# EasyEDA Pro project 实战派S3电池包.epro

# Schematic batterypack
Board Name: 扩展板; Create Date: 2025-04-08; Page Name: P1; Project Name: 实战派s3电池包; Schematic Name: batterypack; Update Date: 2025-04-08; Company: 嘉立创EDA; Page Size: A4; Version: V1.0
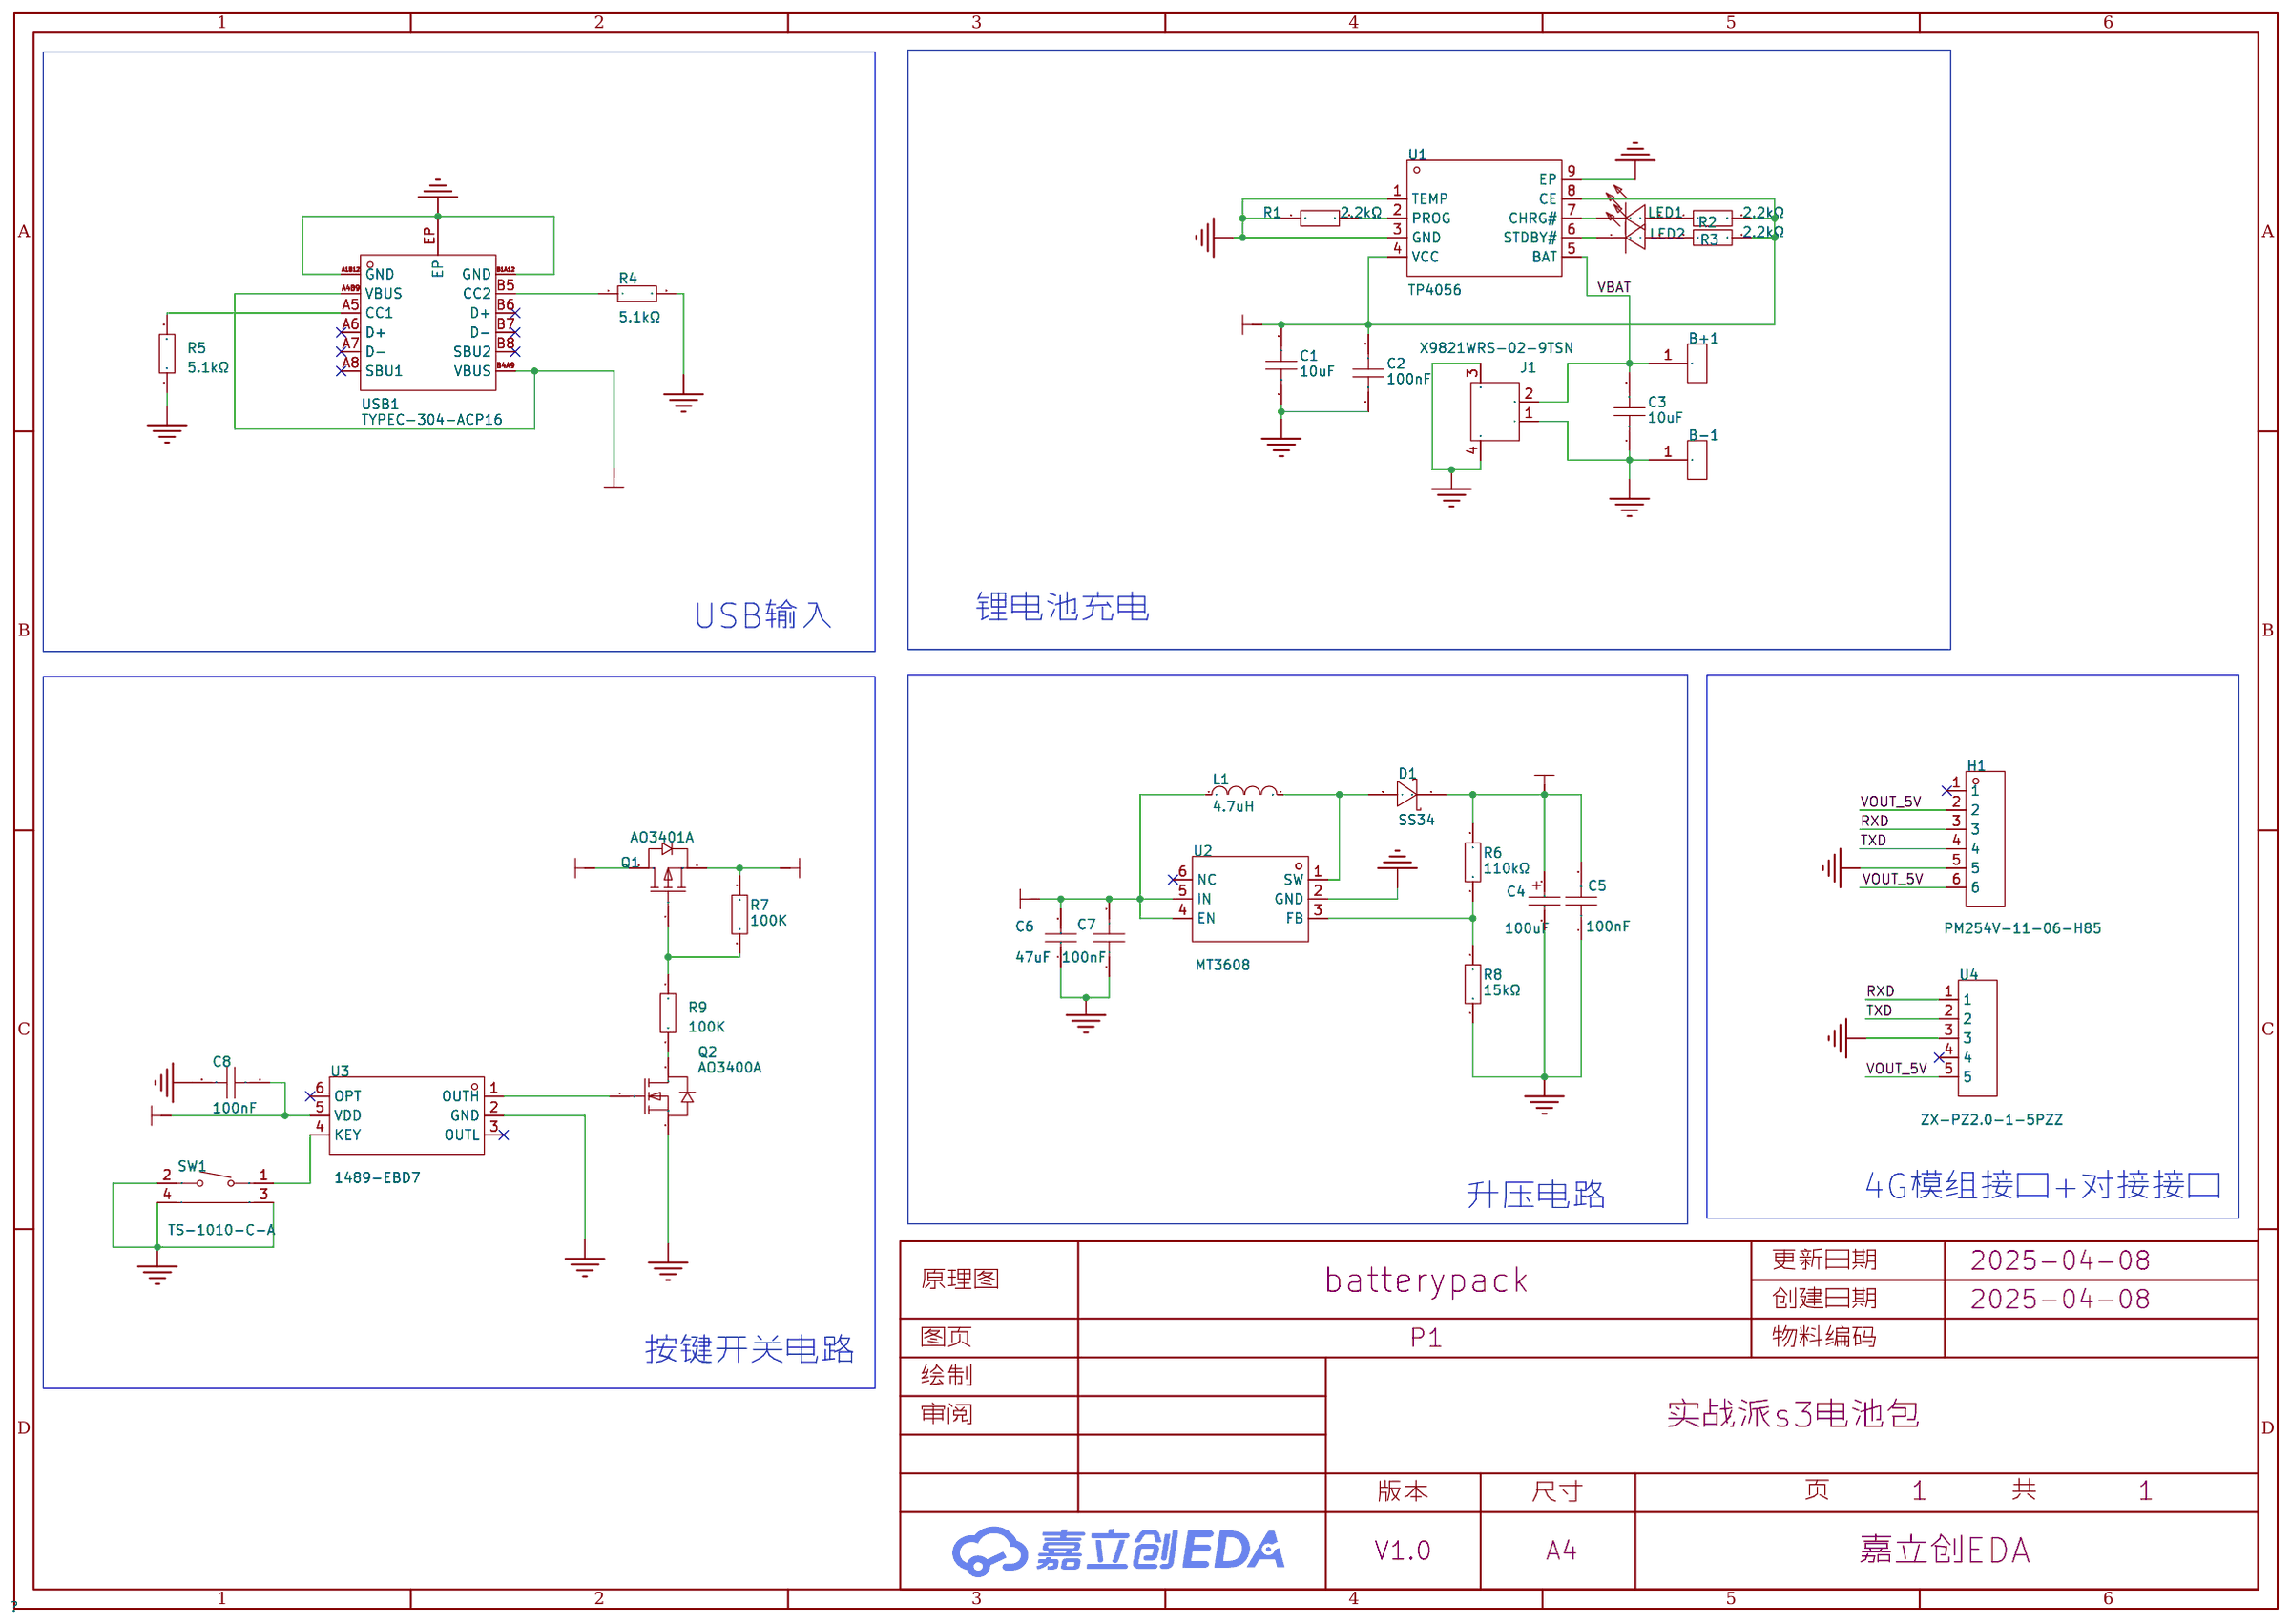
[diagram p0: schematic sheet]

## Parts
B+1  -  [test_point]
B-1  -  [test_point]
C1  10uF  [C0603]
C2  100nF  [C0402]
C3  10uF  [C0603]
C4  100uF  [CASE-B_3528]
C5  100nF  [C0402]
C6  47uF  [C0805]
C7  100nF  [C0402]
C8  100nF  [C0402]
D1  SS34  [SMA_L4.3-W2.6-LS5.2-RD]
H1  PM254V-11-06-H85  [HDR-TH_6P-P2.54-V-F]
J1  X9821WRS-02-9TSN  [CONN-SMD_2P-P1.25_X9821WRS-02-9TSN]
L1  4.7uH  [IND-SMD_L4.4-W4.2]
LED1  KT-0603R  [LED0603-RD]
LED2  KT-0603G  [LED0603-RD]
Q1  AO3401A  [SOT-23_L2.9-W1.3-P1.90-LS2.4-BR]
Q2  AO3400A  [SOT-23-3_L2.9-W1.3-P1.90-LS2.4-BR]
R1  2.2kΩ  [R0402]
R2  2.2kΩ  [R0402]
R3  2.2kΩ  [R0402]
R4  5.1kΩ  [R0402]
R5  5.1kΩ  [R0402]
R6  110kΩ  [R0402]
R7  100K  [R0402]
R8  15kΩ  [R0402]
R9  100K  [R0402]
SW1  TS-1010-C-A  [KEY-SMD_TX-1010-X-X]
U1  TP4056  [ESOP-8_L4.9-W3.9-P1.27-LS6.0-BL-EP]
U2  MT3608  [SOT-23-6_L2.9-W1.6-P0.95-LS2.8-BL]
U3  1489-EBD7  [SOT-23-6_L2.9-W1.6-P0.95-LS2.8-BL]
U4  ZX-PZ2.0-1-5PZZ  [HDR-TH_5P-P2.00-V-M]
USB1  TYPEC-304-ACP16  [USB-C-SMD_TYPE-C-16P-1]

## Library data of the parts
B+1 B-1 = test_point
C1 C3 = CL10A106KP8NNNC: 容值:10uF;精度:±10%;额定电压:10V;材质(温度系数):X5R;; LCSC Part Name: 10uF ±10% 10V; Supplier Part: C19702; Manufacturer: SAMSUNG(三星); Supplier Footprint: 0603; JLCPCB Part Class: Basic Part; Datasheet: https://atta.szlcsc.com/upload/public/pdf/source/20160218/1457707763339.pdf; Supplier: LCSC; Tolerance: ±10%; Voltage Rated: 10V; Temperature Coefficient: X5R
C2 = CL05B104KB54PNC: 容值:100nF;精度:±10%;额定电压:50V;材质(温度系数):X7R;; LCSC Part Name: 100nF ±10% 50V; Supplier Part: C307331; Manufacturer: SAMSUNG(三星); Supplier Footprint: 0402; JLCPCB Part Class: 基础库; Datasheet: https://atta.szlcsc.com/upload/public/pdf/source/20160218/1457707763339.pdf; Supplier: LCSC; Tolerance: ±10%; Voltage Rated: 50V; Temperature Coefficient: X7R
C4 = TAJB107K006RNJ: 容值:100uF;精度:±10%;额定电压:6.3V;等效串联电阻:1.7Ω@100kHz;; LCSC Part Name: 100uF ±10% 6.3V; Supplier Part: C16133; Manufacturer: Kyocera AVX; Supplier Footprint: CASE-B-3528-21(mm); JLCPCB Part Class: Basic Part; Datasheet: https://atta.szlcsc.com/upload/public/pdf/source/20160107/1457707750344.pdf; Supplier: LCSC; Tolerance: ±10%; Rated Voltage: 6.3V; Equivalent Series Resistance(ESR): 1.7Ω@100kHz; Operating Temperature: -55℃~+125℃
C5 C7 = CL05B104KB54PNC: 容值:100nF;精度:±10%;额定电压:50V;材质(温度系数):X7R;; LCSC Part Name: 100nF ±10% 50V; Supplier Part: C307331; Manufacturer: SAMSUNG(三星); Supplier Footprint: 0402; JLCPCB Part Class: Basic Part; Datasheet: https://atta.szlcsc.com/upload/public/pdf/source/20160218/1457707763339.pdf; Supplier: LCSC; Tolerance: ±10%; Voltage Rated: 50V; Temperature Coefficient: X7R; Voltage Rating: 50V
C6 = CL21A476MQYNNNE: 容值:47uF;精度:±20%;额定电压:6.3V;材质(温度系数):X5R;; LCSC Part Name: 47uF ±20% 6.3V; Supplier Part: C16780; Manufacturer: SAMSUNG(三星); Supplier Footprint: 0805; JLCPCB Part Class: Basic Part; Datasheet: https://atta.szlcsc.com/upload/public/pdf/source/20160218/1457707763339.pdf; Supplier: LCSC; Tolerance: ±20%; Voltage Rated: 6.3V; Temperature Coefficient: X5R
C8 = CAP_0402: Supplier Footprint: 0402
D1 = SS34_C8678: 二极管配置:独立式;正向压降(Vf):550mV@3A;直流反向耐压(Vr):40V;整流电流:3A;; LCSC Part Name: 电压:40V 电流:3A; Supplier Part: C8678; Manufacturer: MDD(辰达半导体); Supplier Footprint: SMA(DO-214AC); JLCPCB Part Class: 基础库; Datasheet: https://atta.szlcsc.com/upload/public/pdf/source/20240710/2118BB86FDDB2E0B294389AC1F3F65C8.pdf; Supplier: LCSC; Diode Configuration: 独立式; Forward Voltage (Vf@If): 550mV@3A; Reverse Voltage (Vr): 40V; Rectified Current: 3A; Reverse Leakage Current (Ir): 500uA@40V
H1 = PM254V-11-06-H85: 插孔结构:1x6P;间距:2.54mm;行距:-;圆孔/方孔:方孔;安装类型:直插;排数:单排;总孔位数:6P;额定电流:3A;额定电压:250V;插孔方向:顶部;塑高:-;工作温度范围:-40℃~+105℃;; LCSC Part Name: 间距:2.54mm 1x6P 直插; Supplier Part: C2832269; Manufacturer: XFCN(兴飞); Supplier Footprint: 插件,P=2.54mm; JLCPCB Part Class: 扩展库; Datasheet: https://atta.szlcsc.com/upload/public/pdf/source/20210514/C2832269_B3EC97736B37C2783BDCE3050AA57447.pdf; Supplier: LCSC; Holes Structure: 1x6P; Pitch: 2.54mm; Circular Hole / Square Hole: 方孔; Mounting Type: 直插; Number of Rows: 单排; Number of Holes: 6P; Current Rating (Max): 3A; Voltage Rating (Max): 250V; Holes Direction: 顶部; Operating Temperature Range: -40℃~+105℃
J1 = X9821WRS-02-9TSN: 参考系列:-;间距:1.25mm;插针结构:1x2P;排数:1;每排PIN数:2;行距:-;公母:母型插口;安装方式:卧贴;额定电流:1A;触头材质:黄铜;触头镀层:锡;工作温度范围:-25℃~+85℃;焊接温度(最大值):260℃;; LCSC Part Name: 1.25mm 1x2P 卧贴 高温; Supplier Part: C397377; Manufacturer: XKB Connectivity(中国星坤); Supplier Footprint: SMD,P=1.25mm; JLCPCB Part Class: 扩展库; Datasheet: https://atta.szlcsc.com/upload/public/pdf/source/20211009/8EC70A3756BF98D2018F34C331B3A406.pdf; Supplier: LCSC; Pitch: 1.25mm; Pins Structure: 1x2P; Number of Rows: 1; Number of PINs Per Row: 2; Gender: 母型插口; Mounting Style: 卧贴; Current Rating (Max): 1A; Contact Material: 黄铜; Contact Plating: 锡; Operating Temperature Range: -25℃~+85℃; Welding Temperature (Max): 260℃; Check: true
L1 = FXL0420-4R7-M: 电感值:4.7uH;精度:±20%;额定电流:2.8A;饱和电流(Isat):3A;类型:一体成型电感;; LCSC Part Name: 4.7uH ±20% 3A; Supplier Part: C167208; Manufacturer: cjiang(长江微电); Supplier Footprint: SMD,4.2x4.4mm; JLCPCB Part Class: Extended Part; Datasheet: https://atta.szlcsc.com/upload/public/pdf/source/20240426/3189EA8206330E2108542F9E34E540E7.pdf; Supplier: LCSC; Tolerance: ±20%; Rated Current: 2.8A; Saturation Current (Isat): 3A; DC Resistance (DCR): 105mΩ; Type: 一体成型电感
LED1 = KT-0603R: 发光颜色:红色;功率:-;正向电流:-;主波长:-;二极管配置:-;透镜颜色:-;色温:-;发光角度:-;载带方式:-;工作温度:-40℃~+85℃;; LCSC Part Name: 0603 红灯 高亮; Supplier Part: C2286; Manufacturer: KENTO; Supplier Footprint: 0603; JLCPCB Part Class: 基础库; Datasheet: https://atta.szlcsc.com/upload/public/pdf/source/20160616/1466072038404.pdf; Supplier: LCSC; Emitted Color: 红色; Operating Temperature: -40℃~+85℃
LED2 = KT-0603G: 发光颜色:翠绿色;; LCSC Part Name: 0603 翠绿 高亮; Supplier Part: C12624; Manufacturer: KENTO; Supplier Footprint: 0603; JLCPCB Part Class: 扩展库; Datasheet: https://atta.szlcsc.com/upload/public/pdf/source/20160120/1457707754255.pdf; Supplier: LCSC; Emitted Color: 翠绿色
Q1 = AO3401A_C15127: 类型:P沟道;漏源电压(Vdss):30V;连续漏极电流(Id):4A;功率(Pd):1.4W;导通电阻(RDS(on)@Vgs,Id):44mΩ@10V,4.3A;阈值电压(Vgs(th)@Id):1.3V@250uA;; LCSC Part Name: P沟道 耐压:30V 电流:4A; Supplier Part: C15127; Manufacturer: AOS; Supplier Footprint: SOT-23; Datasheet: https://atta.szlcsc.com/upload/public/pdf/source/20160507/1462613609053.pdf; Supplier: LCSC; Type: P沟道; Drain Source Voltage (Vdss): 30V; Continuous Drain Current (Id): 4A; Power Dissipation (Pd): 1.4W; Drain Source On Resistance (RDS(on)@Vgs,Id): 44mΩ@10V,4.3A; Gate Threshold Voltage (Vgs(th)@Id): 1.3V@250uA; Total Gate Charge (Qg@Vgs): 12.2nC@4.5V; Input Capacitance (Ciss@Vds): 1.2nF@15V; Operating Temperature: -55℃~+150℃@(Tj)
Q2 = AO3400A_C20917: 类型:1个N沟道;漏源电压(Vdss):30V;连续漏极电流(Id):5.7A;导通电阻(RDS(on)@Vgs,Id):26.5mΩ@10V,5.7A;功率(Pd):1.4W;阈值电压(Vgs(th)@Id):1.5V@250uA;; LCSC Part Name: 1个N沟道 耐压:30V 电流:5.7A; Supplier Part: C20917; Manufacturer: AOS; Supplier Footprint: SOT-23-3L; JLCPCB Part Class: 基础库; Datasheet: https://atta.szlcsc.com/upload/public/pdf/source/20140107/1457706668533.pdf; Supplier: LCSC; Type: 1个N沟道; Drain Source Voltage (Vdss): 30V; Continuous Drain Current (Id): 5.7A; Drain Source On Resistance (RDS(on)@Vgs,Id): 26.5mΩ@10V,5.7A; Power Dissipation (Pd): 1.4W; Gate Threshold Voltage (Vgs(th)@Id): 1.5V@250uA; Total Gate Charge (Qg@Vgs): 7nC@4.5V; Input Capacitance (Ciss@Vds): 630pF@15V; Operating Temperature: -55℃~+150℃@(Tj)
R1-R3 = 0402WGF2201TCE: 电阻类型:厚膜电阻;阻值:2.2kΩ;精度:±1%;功率:62.5mW;最大工作电压:50V;温度系数:±100ppm/℃;; LCSC Part Name: 2.2kΩ ±1% 62.5mW 厚膜电阻; Supplier Part: C25879; Manufacturer: UNI-ROYAL(厚声); Supplier Footprint: 0402; JLCPCB Part Class: Basic Part; Datasheet: https://atta.szlcsc.com/upload/public/pdf/source/20200306/C422600_1E6D84923E4A46A82E41ADD87F860B5C.pdf; Supplier: LCSC; Type: 厚膜电阻; Tolerance: ±1%; Power(Watts): 62.5mW; Overload Voltage (Max): 50V; Temperature Coefficient: ±100ppm/℃; Operating Temperature Range: -55℃~+155℃
R4 R5 = 0402WGF5101TCE: 电阻类型:厚膜电阻;阻值:5.1kΩ;精度:±1%;功率:62.5mW;最大工作电压:50V;温度系数:±100ppm/℃;; LCSC Part Name: 5.1kΩ ±1% 62.5mW 厚膜电阻; Supplier Part: C25905; Manufacturer: UNI-ROYAL(厚声); Supplier Footprint: 0402; JLCPCB Part Class: Basic Part; Datasheet: https://atta.szlcsc.com/upload/public/pdf/source/20200306/C422600_1E6D84923E4A46A82E41ADD87F860B5C.pdf; Supplier: LCSC; Type: 厚膜电阻; Tolerance: ±1%; Power(Watts): 62.5mW; Temperature Coefficient: ±100ppm/℃; Overload Voltage (Max): 50V; Operating Temperature Range: -55℃~+155℃; Check: true
R6 = 0402WGF1003TCE: 电阻类型:厚膜电阻;阻值:100kΩ;精度:±1%;功率:62.5mW;最大工作电压:50V;温度系数:±100ppm/℃;; LCSC Part Name: 100kΩ ±1% 62.5mW 厚膜电阻; Supplier Part: C25741; Manufacturer: UNI-ROYAL(厚声); Supplier Footprint: 0402; JLCPCB Part Class: Basic Part; Datasheet: https://atta.szlcsc.com/upload/public/pdf/source/20200306/C422600_1E6D84923E4A46A82E41ADD87F860B5C.pdf; Supplier: LCSC; Type: 厚膜电阻; Tolerance: ±1%; Power(Watts): 62.5mW; Temperature Coefficient: ±100ppm/℃; Overload Voltage (Max): 50V; Operating Temperature Range: -55℃~+155℃
R7 R9 = Res_0402: Supplier Footprint: 0402
R8 = 0402WGF1502TCE: 电阻类型:厚膜电阻;阻值:15kΩ;精度:±1%;功率:62.5mW;最大工作电压:50V;温度系数:±100ppm/℃;; LCSC Part Name: 15kΩ ±1% 62.5mW 厚膜电阻; Supplier Part: C25756; Manufacturer: UNI-ROYAL(厚声); Supplier Footprint: 0402; JLCPCB Part Class: Basic Part; Datasheet: https://atta.szlcsc.com/upload/public/pdf/source/20200306/C422600_1E6D84923E4A46A82E41ADD87F860B5C.pdf; Supplier: LCSC; Type: 厚膜电阻; Tolerance: ±1%; Power(Watts): 62.5mW; Overload Voltage (Max): 50V; Temperature Coefficient: ±100ppm/℃; Operating Temperature Range: -55℃~+155℃
SW1 = TS-1010-C-A: 电路结构:单刀单掷;按钮形状:矩形按钮;作用力:260gf;安装方式:卧贴;开关长度:2.3mm;开关宽度:4.7mm;开关高度:3.5mm;带支架:不带;触点电流:50mA;额定电压(AC):-;额定电压(DC):12V;额定功率:-;绝缘电阻:-;带灯:无;机械寿命:10万次;; LCSC Part Name: 2.3*4.7*3.5mm 卧贴 轻触开关; Supplier Part: C692458; Manufacturer: XKB Connectivity(中国星坤); Supplier Footprint: SMD; JLCPCB Part Class: 扩展库; Datasheet: https://atta.szlcsc.com/upload/public/pdf/source/20211011/09621D275CE0F472C941775DFBBCCC96.pdf; Supplier: LCSC; Circuit: 单刀单掷; Actuator Style: 矩形按钮; Operating Force: 260gf; Mounting Style: 卧贴; Switch Length: 2.3mm; Switch Width: 4.7mm; Switch Height: 3.5mm; Strike Gundam: 不带; Contact Current: 50mA; Voltage Rating (DC): 12V; Actuator/Cap Color: 黑色; With Lamp: 无; Mechanical Life: 10万次; Operating Temperature: -30℃~+85℃; Check: true
U1 = TP4056_C725790: Supplier Part: C725790; Manufacturer: UMW(友台半导体); Supplier Footprint: ESOP-8; Datasheet: https://atta.szlcsc.com/upload/public/pdf/source/20231109/CF74897CE79A500F7FE27A45ADCCC631.pdf; Supplier: LCSC
U2 = MT3608: 功能类型:升压型;输出类型:可调;工作电压:2V~24V;输出电压:28V;输出电流:2A;; LCSC Part Name: 高效1.2MHz 2A升压转换器; Supplier Part: C84817; Manufacturer: 西安航天民芯; Supplier Footprint: SOT-23-6; JLCPCB Part Class: 扩展库; Datasheet: https://atta.szlcsc.com/upload/public/pdf/source/20161110/1478743351706.pdf; Supplier: LCSC; Function: 升压型; Output Type: 可调; Input Voltage: 2V~24V; Output Voltage: 28V; Output Current: 2A; Switching Frequency: 1.2MHz; Operating Temperature: -40℃~+85℃; Synchronous Rectification: 否; Number of Outputs: 1; Topology: 升压式; Quiescent Current (Iq): 200uA; Switch tube (built-in/external): 内置
U3 = 1489-EBD7: 开关IC  长按 1.5 秒开关机; Manufacturer: 深圳丽晶微; Supplier Footprint: SOT-23-6
U4 = ZX-PZ2.0-1-5PZZ: 插针结构:1x5P;间距:2mm;行距:-;圆针/方针:方针;安装方式:直插;排数:单排;总PIN位数:5P;额定电流:1.5A;额定电压:500V;配合针长度:3.9mm;塑高:2mm;端接针长度:2.8mm;触头材质:黄铜;触头镀层:金;工作温度:-40℃~+105℃;颜色:黑色;; LCSC Part Name: 1x5P 间距:2mm 方针 直插; Supplier Part: C7501286; Manufacturer: Megastar(兆星); Supplier Footprint: 插件,P=2mm; JLCPCB Part Class: 扩展库; Datasheet: https://atta.szlcsc.com/upload/public/pdf/source/20230809/E150E06394DAD00A792C01E768CBE2ED.pdf; Supplier: LCSC; Pin Structure: 1x5P; Pitch: 2mm; Circluar Pins/Square Pins: 方针; Mounting Type: 直插; Number of Rows: 单排; Number of Pins: 5P; Current Rating: 1.5A; Voltage Rating (Max): 500V; Length of Mating Pin: 3.9mm; Insulation Height: 2mm; Length of End Connection Pin: 2.8mm; Contact Material: 黄铜; Contact Plating: 金; Operating Temperature: -40℃~+105℃; Color: 黑色
USB1 = TYPEC-304-ACP16: 连接器类型:Type-C;标准:-;公母:母;端口数量:1;触点数量:16P;安装方式:卧贴;额定电流 - 电源:3A;触头材质:铜;触头镀层:金;工作温度范围:-40℃~+85℃;焊接温度(最大值):-;; LCSC Part Name: Type-C 母 卧贴; Supplier Part: C2982555; Manufacturer: XUNPU(讯普); Supplier Footprint: SMD; Datasheet: https://atta.szlcsc.com/upload/public/pdf/source/20220311/3C907F75E12F45E4EE7F73565AB9C294.pdf; Supplier: LCSC; Connector Type: Type-C; Gender: 母; Number of Ports: 1; Number of Contacts: 16P; Mounting Style: 卧贴; Current Rating - Power (Max): 3A; Contact Material: 铜; Contact Plating: 金; Operating Temperature Range: -40℃~+85℃; Check: true

## Nets
GND: B-1.1 C1.1 C2.1 C3.1 C4.2 C5.1 C6.1 C7.1 C8.2 H1.5 J1.1 J1.3 J1.4 Q2.2(S) R1.1 R4.2 R5.1 R8.1 SW1.2 SW1.3 SW1.4 U1.1(TEMP) U1.3(GND) U1.9(EP) U2.2(GND) U3.2(GND) U4.3 USB1.A1B12(GND) USB1.B1A12(GND) USB1.EP
VBAT: B+1.1 C3.2 C8.1 J1.2 Q1.2(S) R7.2 U1.5(BAT) U3.5(VDD)
VBAT_OUT: C6.2 C7.2 L1.1 Q1.3(D) U2.4(EN) U2.5(IN)
RXD: H1.3 U4.1
TXD: H1.4 U4.2
USB_5V: C1.2 C2.2 R2.2 R3.2 U1.4(VCC) U1.8(CE) USB1.A4B9(VBUS) USB1.B4A9(VBUS)
VOUT_5V: C4.1 C5.2 D1.1(K) H1.2 H1.6 R6.2 U4.5
$1N1495: R1.2 U1.2(PROG)
$1N1497: LED1.1(K) U1.7(CHRG#)
$1N1498: LED2.1(K) U1.6(STDBY#)
$1N2115: R5.2 USB1.A5(CC1)
$1N2116: R4.1 USB1.B5(CC2)
$1N2400: SW1.1 U3.4(KEY)
$1N2472: Q1.1(G) R7.1 R9.1
$1N2521: Q2.3(D) R9.2
$1N2573: Q2.1(G) U3.1(OUTH)
$1N3964: D1.2(A) L1.2 U2.1(SW)
$1N3977: R6.1 R8.2 U2.3(FB)
$1N4236: LED1.2(A) R2.1
$1N4238: LED2.2(A) R3.1

Not connected (* = marked no-connect by the designer): H1 1*; U2 6(NC)*; U3 3(OUTL)* 6(OPT)*; U4 4*; USB1 A6(D+)* A7(D-)* A8(SBU1)* B6(D+)* B7(D-)* B8(SBU2)*

## Notes on the sheet
- USB输入
- 锂电池充电
- 升压电路
- 4G模组接口+对接接口
- 按键开关电路

# Board batterypack
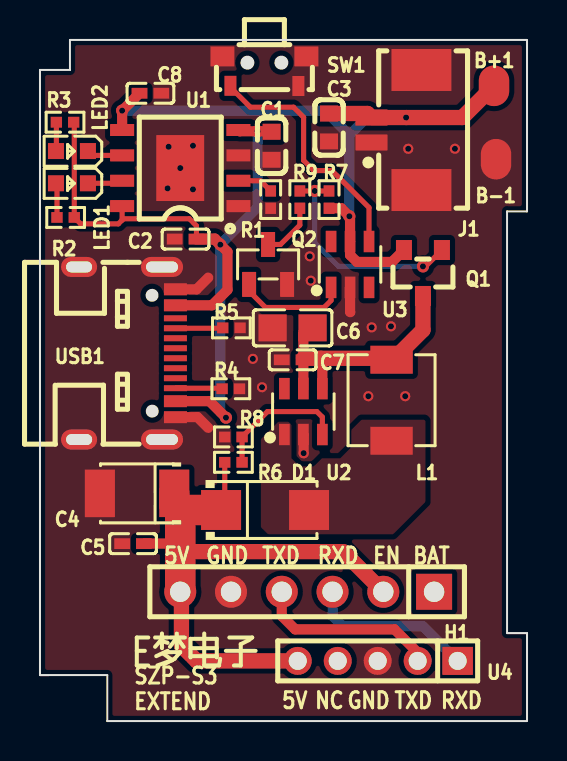
[diagram p1: board, top side]
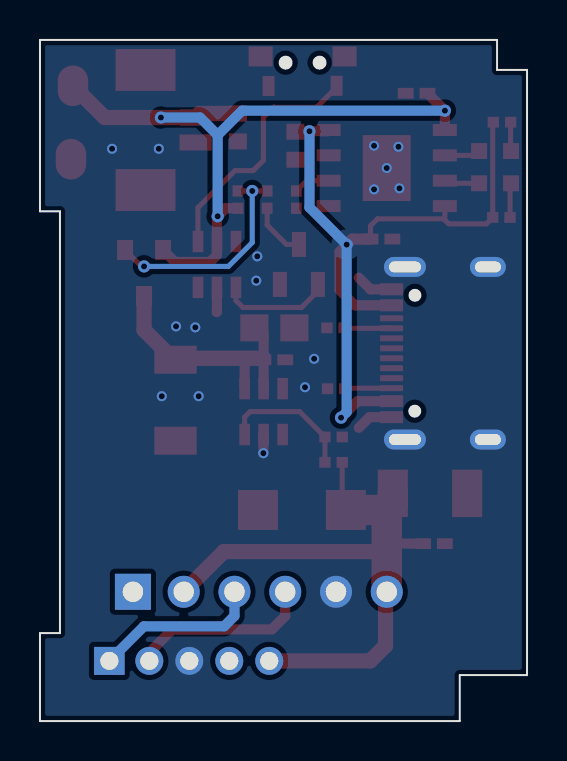
[diagram p2: board, bottom side, seen from below]

Outline 24.37 x 34.1 mm; copper layers: Top Layer, Bottom Layer. Coordinates in mm from the lower left corner of the outline.
Outline path: 0,32.6 0,2.3 3.37,2.3 3.37,0 24.37,0 24.37,4.4 23.37,4.4 23.37,25.52 24.37,25.52 24.37,34.1 1.5,34.1 1.5,32.6 0,32.6
Stack: Top Layer 0.035mm / Dielectric1 0.91mm FR4 er 4.5 / Bottom Layer 0.035mm

## Design rules (mm)
template: 自定义配置
spacing copperThickness1oz (default): track to track 0.102, other pairs 0.152 to 0.3
spacing copperThickness2oz: track to track 0.203, other pairs 0.152 to 0.3
track width copperThickness1oz (default): min 0.127, default 0.254, max 2.54
track width copperThickness2oz: min 0.203, default 0.254, max 2.54
differential pair differentialPair (default): width min 0.127, default 0.254, max 2.54; gap min 0.152, default 0.152
via viaSize (default): diameter min 0.5, default 0.61, max 10; hole min 0.3, default 0.305, max 6.3
net GND uses copperRegion1
net VBAT_OUT uses copperRegion1
net $1N3964 uses copperRegion1

## Placement (name value [footprint] x y rotation side)
B+1  -  [test_point#2]  22.72 31.8 0 top
B-1  -  [test_point]  22.82 28.13 270 top
C1  10uF  [C0603]  11.59 28.8 90 top
C2  100nF  [C0402]  7.28 24.13 0 top
C3  10uF  [C0603]  14.46 29.72 90 top
C4  100uF  [CASE-B_3528]  4.86 11.4 180 top
C5  100nF  [C0402]  4.66 8.88 0 top
C6  47uF  [C0805]  12.64 19.68 0 top
C7  100nF  [C0402]  12.64 18.08 0 top
C8  100nF  [C0402]  5.53 31.43 0 top
D1  SS34  [SMA_L4.3-W2.6-LS5.2-RD]  11.26 10.57 0 top
H1  PM254V-11-06-H85  [HDR-TH_6P-P2.54-V-F]  13.37 6.47 180 top
J1  X9821WRS-02-9TSN  [CONN-SMD_2P-P1.25_X9821WRS-02-9TSN]  17.84 29.59 90 top
L1  4.7uH  [IND-SMD_L4.4-W4.2]  17.59 16.06 90 top
LED1  KT-0603R  [LED0603-RD]  1.6 26.92 180 top
LED2  KT-0603G  [LED0603-RD]  1.6 28.54 180 top
Q1  AO3401A  [SOT-23_L2.9-W1.3-P1.90-LS2.4-BR]  19.16 22.43 90 top
Q2  AO3400A  [SOT-23-3_L2.9-W1.3-P1.90-LS2.4-BR]  11.41 22.86 270 top
R1  2.2kΩ  [R0402]  11.54 26.11 90 top
R2  2.2kΩ  [R0402]  1.28 25.21 0 top
R3  2.2kΩ  [R0402]  1.25 29.98 0 top
R4  5.1kΩ  [R0402]  9.55 16.64 0 top
R5  5.1kΩ  [R0402]  9.58 19.68 180 top
R6  110kΩ  [R0402]  9.68 12.95 180 top
R7  100K  [R0402]  14.46 26.11 270 top
R8  15kΩ  [R0402]  9.68 14.22 0 top
R9  100K  [R0402]  13 26.11 270 top
SW1  TS-1010-C-A  [KEY-SMD_TX-1010-X-X]  11.23 32.64 0 top
U1  TP4056  [ESOP-8_L4.9-W3.9-P1.27-LS6.0-BL-EP]  7.02 27.69 90 top
U2  MT3608  [SOT-23-6_L2.9-W1.6-P0.95-LS2.8-BL]  13.18 15.49 0 top
U3  1489-EBD7  [SOT-23-6_L2.9-W1.6-P0.95-LS2.8-BL]  15.51 22.86 0 top
U4  ZX-PZ2.0-1-5PZZ  [HDR-TH_5P-P2.00-V-M]  16.9 3.01 180 top
USB1  TYPEC-304-ACP16  [USB-C-SMD_TYPE-C-16P-1]  4.37 18.41 270 top

## Footprints (pads in the part's own frame, mm; a bottom-side part is the same pattern mirrored in y, then rotated)
C0402
  rect 0.79x0.54 smd: 1(-0.545,0) 2(0.545,0)
C0603
  rect 0.8x0.9 smd: 1(-0.7,0) 2(0.7,0)
C0805
  rect 1.41x1.35 smd: 1(-1,0) 2(1,0)
CASE-B_3528
  rect 1.506x2.376 smd: 1(-1.861,0) 2(1.861,0)
CONN-SMD_2P-P1.25_X9821WRS-02-9TSN
  rect 0.8x1.6 smd: 1(-0.625,1.25) 2(0.625,1.25)
  rect 2.1x3 smd: 3(3.005,-1.25) 4(-3.005,-1.25)
ESOP-8_L4.9-W3.9-P1.27-LS6.0-BL-EP
  rect 0.6x1.2 smd: 1(-1.905,-2.909) 2(-0.635,-2.909) 3(0.635,-2.909) 4(1.905,-2.909) 5(1.905,2.909) 6(0.635,2.909) 7(-0.635,2.909) 8(-1.905,2.909)
  rect 3.3x2.4 smd: 9(0,0)
HDR-TH_5P-P2.00-V-M
  rect 1.524x1.4 hole 0.9: 1(-4,0)
  round 1.4 hole 0.9: 2(-2,0) 3(0,0) 4(2,0) 5(4,0)
HDR-TH_6P-P2.54-V-F
  rect 1.8x1.8 hole 1.02: 1(-6.35,0)
  round 1.6 hole 1.02: 2(-3.81,0) 3(-1.27,0) 4(1.27,0) 5(3.81,0) 6(6.35,0)
IND-SMD_L4.4-W4.2
  rect 1.4x2.12 smd: 1(2.028,0) 2(-2.028,0)
KEY-SMD_TX-1010-X-X
  rect 0.6x1 smd: 1(-1.7,-0.835) 2(1.7,-0.845)
  rect 1.2x1 smd: 3(-2.1,0.635) 4(2.1,0.635)
LED0603-RD
  rect 0.8x0.8 smd: 1(-0.799,0) 2(0.799,0)
R0402
  rect 0.566x0.54 smd: 1(-0.433,0) 2(0.433,0)
SMA_L4.3-W2.6-LS5.2-RD
  rect 2x2 smd: 1(-2.2,0) 2(2.2,0)
SOT-23-3_L2.9-W1.3-P1.90-LS2.4-BR
  rect 1.25x0.7 smd: 1(1,-0.95) 2(1,0.95) 3(-1,0)
SOT-23-6_L2.9-W1.6-P0.95-LS2.8-BL
  rect 0.532x1.072 smd: 1(-0.95,-1.149) 2(0,-1.149) 3(0.95,-1.149) 4(0.95,1.149) 5(0,1.149) 6(-0.95,1.149)
SOT-23_L2.9-W1.3-P1.90-LS2.4-BR
  rect 1x0.8 smd: 1(1.15,-0.95) 2(1.15,0.95) 3(-1.15,0)
test_point
  oval 2.032x1.524 smd: 1(0,0)
test_point#2
  oval 1.524x2.032 smd: 1(0,0)
USB-C-SMD_TYPE-C-16P-1
  rect 0.6x1.15 smd: A1B12(-3.2,2.41) A4B9(-2.4,2.41) B1A12(3.2,2.41) B4A9(2.4,2.41)
  rect 0.3x1.15 smd: A5(-1.25,2.41) A6(-0.25,2.41) A7(0.25,2.41) A8(1.25,2.41) B5(1.75,2.41) B6(0.75,2.41) B7(-0.75,2.41) B8(-1.75,2.41)
  oval 1x2.1 hole 0.55x1.6: EP(-4.32,1.74) EP(4.32,1.74)
  oval 1x1.8 hole 0.55x1.3: EP(-4.32,-2.41) EP(4.32,-2.41)

## Nets
As in the schematic.

Pads without a net: H1 1; U2 6; U3 3 6; U4 4; USB1 A6 A7 A8 B6 B7 B8

## Via types
v1: diameter 0.508, hole 0.305, Top Layer to Bottom Layer, 16 vias
v2: diameter 0.61, hole 0.305, Top Layer to Bottom Layer, 8 vias

## Routing (per net, layer and track width the routed paths; a pad name or vN(x,y) marks a point on that pad's centre or on a via; arc(x,y) is an arc through that point)
GND: length 5.9
  Top Layer w0.508: 8.42,14.68 7.88,15.21 USB1.B1A12 ; 8.42,22.2 7.83,21.61 USB1.A1B12 ; U3.2 15.51,20.49 15.53,20.47 ; U2.2 13.19,14.33 v1(13.19,13.41)
  vias: v1(6.44,28.75) v1(6.38,26.67) v1(7.02,27.69) v1(7.65,28.8) v1(7.65,26.62) v1(10.65,18.14) v1(11.11,16.71) v1(13.5,23.27) v1(13.55,22.05) v1(16.43,16.26) v1(16.6,19.71) v1(17.56,19.76) v1(18.27,16.26) v1(18.42,28.65) v1(20.76,28.65)
VBAT: length 36.6
  Top Layer w0.508: Q1.2 17.62,22.99 15.86,22.99 15.51,23.33 U3.5 15.51,25.24 15.08,25.67 R7.2 ; U1.5 v2(4.11,30.56) C8.1
  Top Layer w0.762: B+1.1 21.13,30.22 v2(18.32,30.22) J1.2 16.38,30.42 C3.2
  Bottom Layer w0.508: v2(18.32,30.22) 16.36,30.22 15.48,29.34 ; v2(15.48,25.27) 15.48,29.34 ; 15.48,29.34 14.25,30.56 v2(4.11,30.56)
VBAT_OUT: length 12.9
  Top Layer w0.254: 13.11,19.68 13.18,19.62 13.18,19.48 13.14,19.45
  Top Layer w0.508: 14.05,18.16 14.13,18.08 U2.4 ; U2.5 13.18,19.48
  Top Layer w0.762: Q1.3 19.16,19.58 17.74,18.16 13.19,18.16
RXD: length 8.4
  Bottom Layer w0.508: U4.1 19.17,4.74 15.15,4.74 14.64,5.26 H1.3
TXD: length 9.2
  Top Layer w0.508: H1.4 12.1,5.26 12.77,4.59 17.74,4.59 18.9,3.43 U4.2
USB_5V: length 39.2
  Top Layer w0.254: 4.11,25.08 3.92,24.89 2.04,24.89 R2.2 1.72,29.95 R3.2 ; 4.11,25.08 4.17,25.15 7.48,25.15 7.83,24.79 7.83,24.13 ; 4.11,25.08 U1.8
  Top Layer w0.508: USB1.B4A9 8.48,16.02 v2(9.31,15.19) ; v2(9.02,23.85) 9.38,23.49 9.38,21.59 8.61,20.81 USB1.A4B9 ; U1.4 9.99,29.53 v2(10.89,29.53) 11.68,29.53
  Top Layer w0.559: v2(9.02,23.85) 8.75,24.13 7.83,24.13
  Bottom Layer w0.508: v2(9.31,15.19) 9.02,15.47 v2(9.02,23.85) 10.89,25.72 v2(10.89,29.53)
VOUT_5V: length 30.7
  Top Layer w0.254: R6.2 9.25,10.75
  Top Layer w0.508: 7.08,6.41 H1.6 ; 6.77,8.88 C5.2
  Top Layer w0.762: 6.77,8.88 7.02,8.64 ; 7.08,6.41 7.08,3.77 7.84,3.01 U4.5 ; H1.2 15.17,8.48 7.35,8.48
  Top Layer w1.524: 7.02,10.57 6.72,10.87 C4.1 ; 7.02,10.57 H1.6 ; 7.02,10.57 D1.1
$1N1495: length 1.8
  Top Layer w0.254: U1.2 11.03,27.05 R1.2
$1N1497: length 1.8
  Top Layer w0.254: LED1.1 3.98,26.92 U1.7
$1N1498: length 1.8
  Top Layer w0.254: U1.6 2.62,28.32 LED2.1
$1N2115: length 2.4
  Top Layer w0.254: USB1.A5 9.12,19.66 R5.2
$1N2116: length 2.3
  Top Layer w0.254: R4.1 9.09,16.66 USB1.B5
$1N2400: length 12.5
  Top Layer w0.254: SW1.1 9.53,31.73 10.52,30.73 12.68,30.73 13.19,30.23 13.19,28.07 13.7,27.56 14.61,27.56 16.46,25.7 U3.4
$1N2472: length 11.2
  Top Layer w0.254: R7.1 v2(13.75,26.54) R9.1 ; v2(19.16,22.76) 19.29,22.76 Q1.1
  Bottom Layer w0.254: v2(19.16,22.76) 14.94,22.76 13.75,23.95 v2(13.75,26.54)
$1N2521: length 2.8
  Top Layer w0.254: Q2.3 12.03,23.86 13,24.83 R9.2
$1N2573: length 5.6
  Top Layer w0.254: U3.1 14.56,21.06 14.21,20.71 11.28,20.71 10.46,21.52 Q2.1
$1N3977: length 6.8
  Top Layer w0.254: R6.1 R8.2 11.38,15.49 13.85,15.49 14.13,15.22 U2.3
$1N4236: length 1.7
  Top Layer w0.254: R2.1 0.85,26.87 LED1.2
$1N4238: length 1.5
  Top Layer w0.254: LED2.2 0.82,28.56 R3.1

## Copper pours and planes (outline as drawn; the poured copper is in the pictures)
GND on Top Layer: -3.55,37.13 26.93,37.13 26.93,-4.06 -3.55,-4.06
GND on Bottom Layer: -2.43,35.43 26.27,35.43 26.27,-3.18 -2.43,-3.18
$1N3964 on Top Layer: 11.92,14.99 11.05,14.12 11.05,9.7 11.41,9.35 17.66,9.35 19.29,10.97 19.29,15.04 19.24,15.09 16.09,15.09 15.58,14.58 15.58,13.72 15.02,13.16 14.11,13.16 13.7,12.75 12.99,12.75 12.58,13.16 12.58,14.83 12.43,14.99

## Text on the board
Top Silkscreen Layer: SZP-S3 / EXTEND | 5V | GND | TXD | NC | RXD | EN | BAT | E梦电子
